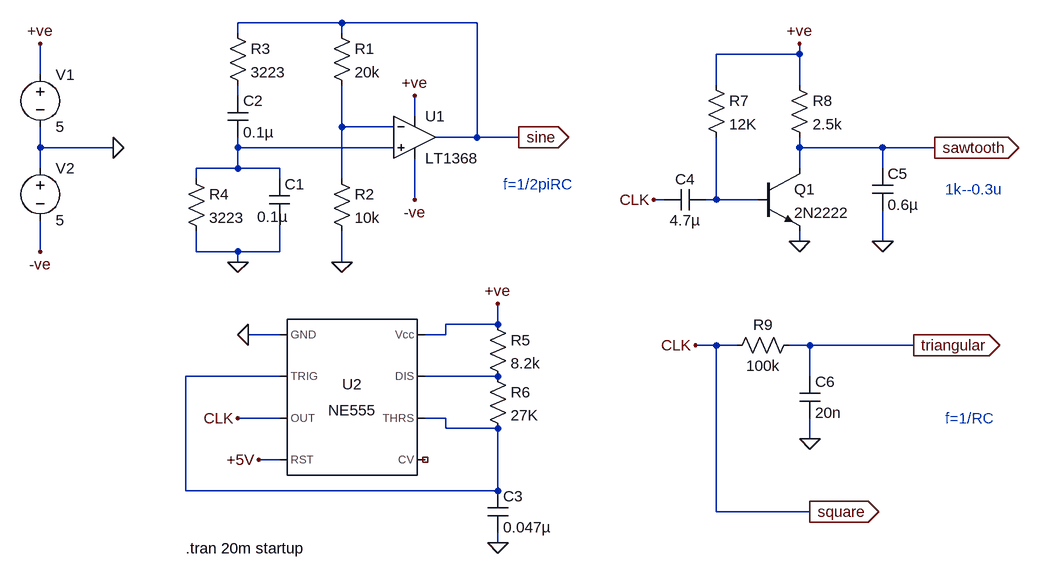
[diagram p0: schematic si_4type.asc]
si_4type.asc, the LTspice schematic file:
Version 4
SHEET 1 1576 792
WIRE 432 -128 272 -128
WIRE 640 -128 432 -128
WIRE 272 -112 272 -128
WIRE 432 -112 432 -128
WIRE 1136 -80 1136 -96
WIRE 1136 -80 1008 -80
WIRE -32 -48 -32 -96
WIRE 1008 -32 1008 -80
WIRE 1136 -32 1136 -80
WIRE 272 -16 272 -32
WIRE 544 16 544 -16
WIRE 432 32 432 -32
WIRE 512 32 432 32
WIRE 640 48 640 -128
WIRE 640 48 576 48
WIRE 704 48 640 48
WIRE -32 64 -32 32
WIRE 80 64 -32 64
WIRE 272 64 272 48
WIRE 512 64 272 64
WIRE 1136 64 1136 48
WIRE 1264 64 1136 64
WIRE 1344 64 1264 64
WIRE -32 96 -32 64
WIRE 272 96 272 64
WIRE 272 96 208 96
WIRE 336 96 272 96
WIRE 1136 96 1136 64
WIRE 1264 96 1264 64
WIRE 208 112 208 96
WIRE 336 112 336 96
WIRE 432 112 432 32
WIRE 544 144 544 80
WIRE 928 144 912 144
WIRE 1008 144 1008 48
WIRE 1008 144 992 144
WIRE 1072 144 1008 144
WIRE 1136 208 1136 192
WIRE 1264 208 1264 160
WIRE -32 224 -32 176
WIRE 208 224 208 192
WIRE 272 224 208 224
WIRE 336 224 336 176
WIRE 336 224 272 224
WIRE 272 240 272 224
WIRE 432 240 432 192
WIRE 672 336 672 304
WIRE 672 336 592 336
WIRE 336 352 288 352
WIRE 592 352 592 336
WIRE 592 352 560 352
WIRE 1008 368 976 368
WIRE 1040 368 1008 368
WIRE 1152 368 1120 368
WIRE 1312 368 1152 368
WIRE 336 416 192 416
WIRE 672 416 560 416
WIRE 1152 416 1152 368
WIRE 336 480 272 480
WIRE 592 480 560 480
WIRE 592 496 592 480
WIRE 672 496 592 496
WIRE 1152 512 1152 480
WIRE 336 544 304 544
WIRE 192 592 192 416
WIRE 672 592 672 496
WIRE 672 592 192 592
WIRE 1008 624 1008 368
WIRE 1152 624 1008 624
WIRE 672 672 672 656
FLAG 432 240 0
FLAG 272 240 0
FLAG 544 -16 +ve
FLAG 544 144 -ve
FLAG 80 64 0
FLAG -32 -96 +ve
FLAG -32 224 -ve
FLAG 704 48 sine
IOPIN 704 48 Out
FLAG 672 304 +ve
FLAG 272 480 CLK
FLAG 304 544 +5V
FLAG 288 352 0
FLAG 672 672 0
FLAG 1136 -96 +ve
FLAG 1136 208 0
FLAG 912 144 CLK
FLAG 1264 208 0
FLAG 1344 64 sawtooth
IOPIN 1344 64 Out
FLAG 976 368 CLK
FLAG 1152 512 0
FLAG 1152 624 square
IOPIN 1152 624 Out
FLAG 1312 368 triangular
IOPIN 1312 368 Out
SYMBOL res 416 -128 R0
SYMATTR InstName R1
SYMATTR Value 20k
SYMBOL res 416 96 R0
SYMATTR InstName R2
SYMATTR Value 10k
SYMBOL cap 320 112 R0
WINDOW 3 -18 58 Left 2
SYMATTR Value 0.1µ
SYMATTR InstName C1
SYMBOL cap 256 -16 R0
SYMATTR InstName C2
SYMATTR Value 0.1µ
SYMBOL voltage -32 -64 R0
WINDOW 123 0 0 Left 0
WINDOW 39 0 0 Left 0
SYMATTR InstName V1
SYMATTR Value 5
SYMBOL voltage -32 80 R0
WINDOW 123 0 0 Left 0
WINDOW 39 0 0 Left 0
SYMATTR InstName V2
SYMATTR Value 5
SYMBOL Opamps\\LT1368 544 -16 R0
SYMATTR InstName U1
SYMBOL res 256 -128 R0
SYMATTR InstName R3
SYMATTR Value 3223
SYMBOL res 192 96 R0
SYMATTR InstName R4
SYMATTR Value 3223
SYMBOL Misc\\NE555 448 448 R0
SYMATTR InstName U2
SYMBOL res 656 320 R0
SYMATTR InstName R5
SYMATTR Value 8.2k
SYMBOL res 656 400 R0
SYMATTR InstName R6
SYMATTR Value 27K
SYMBOL cap 656 592 R0
SYMATTR InstName C3
SYMATTR Value 0.047µ
SYMBOL npn 1072 96 R0
SYMATTR InstName Q1
SYMATTR Value 2N2222
SYMBOL res 992 -48 R0
SYMATTR InstName R7
SYMATTR Value 12K
SYMBOL res 1120 -48 R0
SYMATTR InstName R8
SYMATTR Value 2.5k
SYMBOL cap 992 128 R90
WINDOW 0 0 32 VBottom 2
WINDOW 3 32 32 VTop 2
SYMATTR InstName C4
SYMATTR Value 4.7µ
SYMBOL cap 1248 96 R0
SYMATTR InstName C5
SYMATTR Value 0.6µ
SYMBOL res 1136 352 R90
WINDOW 0 0 56 VBottom 2
WINDOW 3 32 56 VTop 2
SYMATTR InstName R9
SYMATTR Value 100k
SYMBOL cap 1136 416 R0
SYMATTR InstName C6
SYMATTR Value 20n
TEXT 680 120 Left 2 ;f=1/2piRC
TEXT 192 680 Left 2 !.tran 20m startup
TEXT 1360 128 Left 2 ;1k--0.3u
TEXT 1360 480 Left 2 ;f=1/RC

The netlist it stands for:
* si_4type.asc
R1 sine N002 20k
R2 N002 0 10k
C1 N003 0 0.1µ
C2 N001 N003 0.1µ
V1 +ve 0 5
V2 0 -ve 5
XU1 N003 N002 +ve -ve sine LT1368  ; pins In+ In- V+ V- OUT
R3 sine N001 3223
R4 N003 0 3223
XU2 0 N005 square +5V NC_01 N005 N006 +ve NE555  ; pins GND TRIG OUT RST CV THRS DIS Vcc
R5 +ve N006 8.2k
R6 N006 N005 27K
C3 N005 0 0.047µ
Q1 sawtooth N004 0 0 2N2222
R7 +ve N004 12K
R8 +ve sawtooth 2.5k
C4 N004 square 4.7µ
C5 sawtooth 0 0.6µ
R9 triangular square 100k
C6 triangular 0 20n
.model NPN NPN
.model PNP PNP
.lib standard.bjt
* f=1/2piRC
.tran 20m startup
* 1k--0.3u
* f=1/RC
.lib NE555.sub
.backanno
.end